# Altium schematic sheet Peripherals.SchDoc
size A4; SheetNumber: 3; SheetTotal: 6
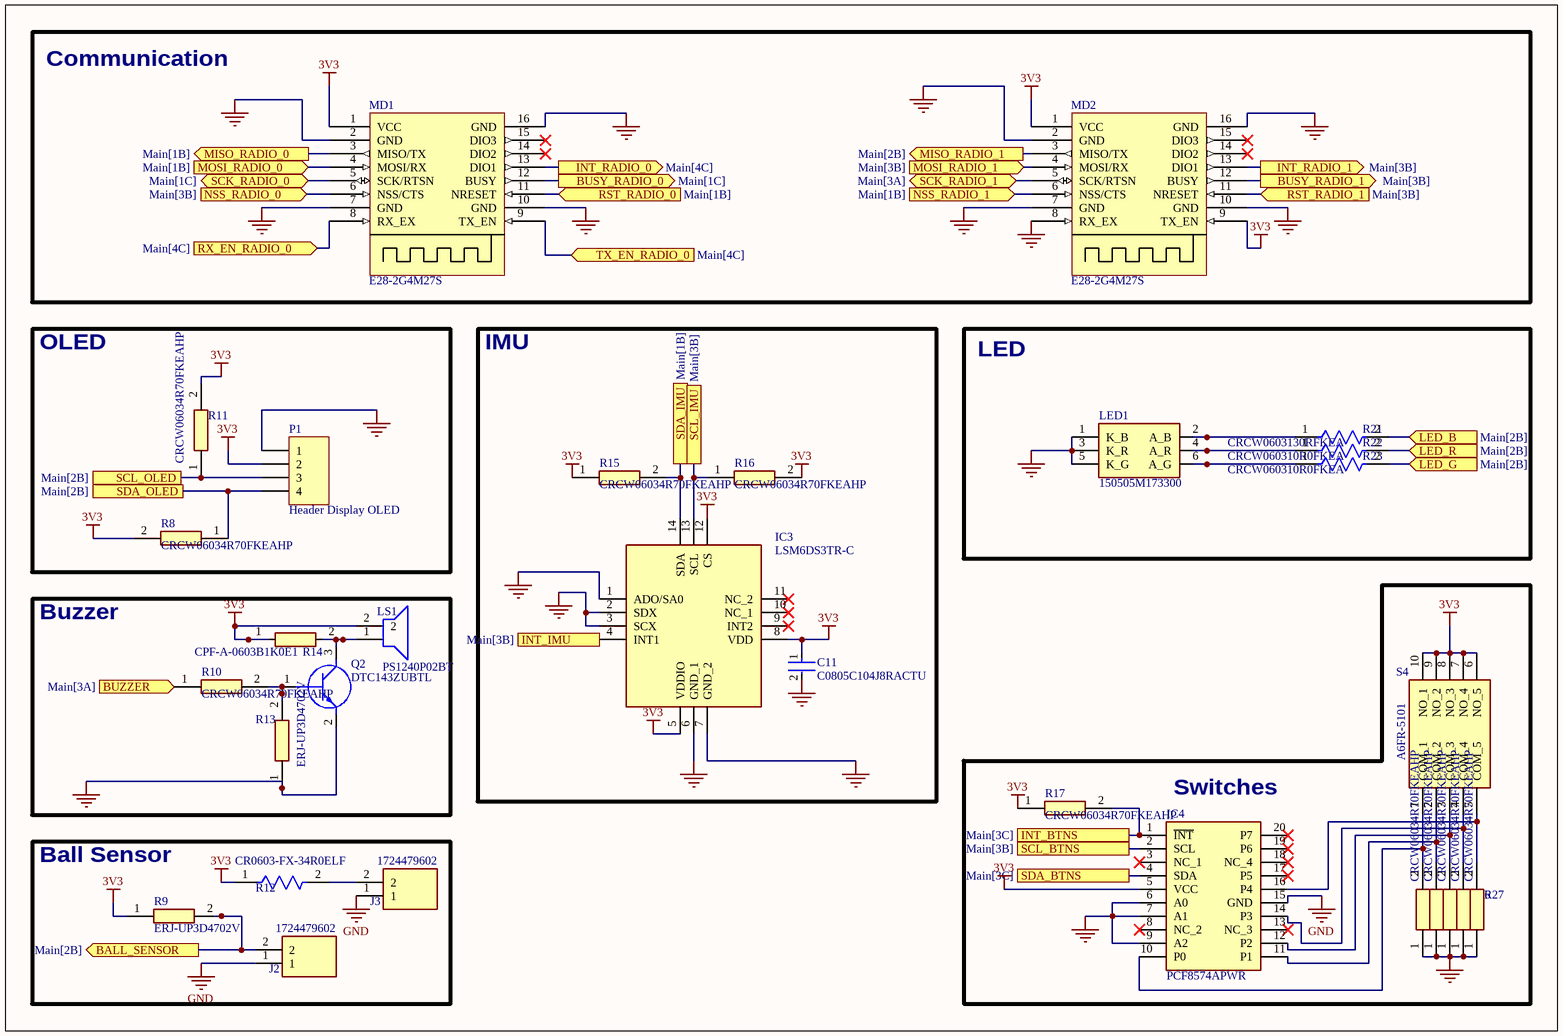
[diagram p0: Peripherals.SchDoc]

## Parts
C11  C0805C104J8RACTU  [FP-C0805C-DN-MFG]
IC3  LSM6DS3TR-C  [LGA-14(2.5X3X0.86)]
IC4  PCF8574APWR  [SOP65P640X120-20N]
J2  1724479602  [172447_94959697_02]
J3  1724479602  [172447_94959697_02]
LED1  150505M173300  [150505M173300]
LS1  PS1240P02BT  [PS1240P02BT]
MD1  E28-2G4M27S  [E28-2G4M27S]
MD2  E28-2G4M27S  [E28-2G4M27S]
P1  Header Display OLED  [OLED]
Q2  DTC143ZUBTL  [SOTFL65P210X105-3N]
R8  CRCW06034R70FKEAHP  [RESC1608X55N]
R9  ERJ-UP3D4702V  [ERJUP3]
R10  CRCW06034R70FKEAHP  [RESC1608X55N]
R11  CRCW06034R70FKEAHP  [RESC1608X55N]
R12  CR0603-FX-34R0ELF  [FP-CR0603-MFG]
R13  ERJ-UP3D4702V  [ERJUP3]
R14  CPF-A-0603B1K0E1  [RESC1608X55N]
R15  CRCW06034R70FKEAHP  [RESC1608X55N]
R16  CRCW06034R70FKEAHP  [RESC1608X55N]
R17  CRCW06034R70FKEAHP  [RESC1608X55N]
R20  CRCW06034R70FKEAHP  [RESC1608X55N]
R21  CRCW0603130RFKEA  [FP-CRCW0603-e3-IPC_A]
R22  CRCW060310R0FKEA  [FP-CRCW0603-e3-IPC_A]
R23  CRCW060310R0FKEA  [FP-CRCW0603-e3-IPC_A]
R24  CRCW06034R70FKEAHP  [RESC1608X55N]
R25  CRCW06034R70FKEAHP  [RESC1608X55N]
R26  CRCW06034R70FKEAHP  [RESC1608X55N]
R27  CRCW06034R70FKEAHP  [RESC1608X55N]
S4  A6FR-5101  [A6FR5101]

## Blocks framed on the sheet
Communication: MD1 MD2
OLED: P1 R8 R11
IMU: C11 IC3 R15 R16
LED: LED1 R21-R23
Buzzer: LS1 Q2 R10 R13 R14
Switches: IC4 R17 R20 R24-R27 S4
Ball Sensor: J2 J3 R9 R12

## Ports
BALL_SENSOR (out, see Main[2B]), BUSY_RADIO_0 (out, see Main[1C]), BUSY_RADIO_1 (out, see Main[3B]), BUZZER (in, see Main[3A]), INT_BTNS (see Main[3C]), INT_IMU (out, see Main[3B]), INT_RADIO_0 (out, see Main[4C]), INT_RADIO_1 (out, see Main[3B]), LED_B (in, see Main[2B]), LED_G (in, see Main[2B]), LED_R (in, see Main[2B]), MISO_RADIO_0 (out, see Main[1B]), MISO_RADIO_1 (out, see Main[2B]), MOSI_RADIO_0 (in, see Main[1B]), MOSI_RADIO_1 (in, see Main[3B]), NSS_RADIO_0 (in, see Main[3B]), NSS_RADIO_1 (in, see Main[1B]), RST_RADIO_0 (in, see Main[1B]), RST_RADIO_1 (in, see Main[3B]), RX_EN_RADIO_0 (in, see Main[4C]), SCK_RADIO_0 (bidir, see Main[1C]), SCK_RADIO_1 (bidir, see Main[3A]), SCL_BTNS (see Main[3B]), SCL_IMU (see Main[3B]), SCL_OLED (see Main[2B]), SDA_BTNS (see Main[3C]), SDA_IMU (see Main[1B]), SDA_OLED (see Main[2B]), TX_EN_RADIO_0 (in, see Main[4C])

## Nets
3V3: C11.1 IC3.5(VDDIO) IC3.8(VDD) IC3.12(CS) IC4.5(VCC) LS1.2 MD1.1(VCC) MD2.1(VCC) MD2.9(TX_EN) P1.2 R8.2 R9.1 R11.2 R12.1 R14.1 R15.1 R16.2 R17.1 S4.6(NO_5) S4.7(NO_4) S4.8(NO_3) S4.9(NO_2) S4.10(NO_1)
GND: C11.2 IC3.1(ADO/SA0) IC3.2(SDX) IC3.3(SCX) IC3.6(GND_1) IC3.7(GND_2) IC4.6(A0) IC4.7(A1) IC4.9(A2) IC4.15(GND) J2.1 J3.1 LED1.1(K_B) LED1.3(K_R) LED1.5(K_G) MD1.2(GND) MD1.7(GND) MD1.10(GND) MD1.16(GND) MD2.2(GND) MD2.7(GND) MD2.8(RX_EX) MD2.10(GND) MD2.16(GND) P1.1 Q2.2(E) R13.1 R20.1 R24.1 R25.1 R26.1 R27.1
BALL_SENSOR: J2.2 R9.2 ; port BALL_SENSOR
BUSY_RADIO_0: MD1.12(BUSY) ; port BUSY_RADIO_0
BUSY_RADIO_1: MD2.12(BUSY) ; port BUSY_RADIO_1
BUZZER: R10.1 ; port BUZZER
INT_BTNS: IC4.1(~{INT}) R17.2 ; port INT_BTNS
INT_IMU: IC3.4(INT1) ; port INT_IMU
INT_RADIO_0: MD1.13(DIO1) ; port INT_RADIO_0
INT_RADIO_1: MD2.13(DIO1) ; port INT_RADIO_1
LED_B: R21.2 ; port LED_B
LED_G: R23.2 ; port LED_G
LED_R: R22.2 ; port LED_R
MISO_RADIO_0: MD1.3(MISO/TX) ; port MISO_RADIO_0
MISO_RADIO_1: MD2.3(MISO/TX) ; port MISO_RADIO_1
MOSI_RADIO_0: MD1.4(MOSI/RX) ; port MOSI_RADIO_0
MOSI_RADIO_1: MD2.4(MOSI/RX) ; port MOSI_RADIO_1
NSS_RADIO_0: MD1.6(NSS/CTS) ; port NSS_RADIO_0
NSS_RADIO_1: MD2.6(NSS/CTS) ; port NSS_RADIO_1
RST_RADIO_0: MD1.11(NRESET) ; port RST_RADIO_0
RST_RADIO_1: MD2.11(NRESET) ; port RST_RADIO_1
RX_EN_RADIO_0: MD1.8(RX_EX) ; port RX_EN_RADIO_0
SCK_RADIO_0: MD1.5(SCK/RTSN) ; port SCK_RADIO_0
SCK_RADIO_1: MD2.5(SCK/RTSN) ; port SCK_RADIO_1
SCL_BTNS: IC4.2(SCL) ; port SCL_BTNS
SCL_IMU: IC3.13(SCL) R16.1 ; port SCL_IMU
SCL_OLED: P1.3 R11.1 ; port SCL_OLED
SDA_BTNS: IC4.4(SDA) ; port SDA_BTNS
SDA_IMU: IC3.14(SDA) R15.2 ; port SDA_IMU
SDA_OLED: P1.4 R8.1 ; port SDA_OLED
TX_EN_RADIO_0: MD1.9(TX_EN) ; port TX_EN_RADIO_0
NetIC4_10: IC4.10(P0) R20.2 S4.1(COM_1)
NetIC4_11: IC4.11(P1) R24.2 S4.2(COM_2)
NetIC4_12: IC4.12(P2) R25.2 S4.3(COM_3)
NetIC4_14: IC4.14(P3) R26.2 S4.4(COM_4)
NetIC4_16: IC4.16(P4) R27.2 S4.5(COM_5)
NetJ3_2: J3.2 R12.2
NetLED1_2: LED1.2(A_B) R21.1
NetLED1_4: LED1.4(A_R) R22.1
NetLED1_6: LED1.6(A_G) R23.1
NetLS1_1: LS1.1 Q2.3(C) R14.2
NetQ2_1: Q2.1(B) R10.2 R13.2

Not connected (* = marked no-connect by the designer): IC3 9(INT2)* 10(NC_1)* 11(NC_2)*; IC4 3(NC_1)* 8(NC_2)* 13(NC_3)* 17(P5)* 18(NC_4)* 19(P6)* 20(P7)*; MD1 14(DIO2)* 15(DIO3)*; MD2 14(DIO2)* 15(DIO3)*

## Library data of the parts
C11 = CMP-03020-032188-1: CAP CER 0.1UF 10V 5% X7R 0805; Manufacturer: KEMET; Material: Ceramic; Tolerance: 0.05; Capacitance: 0.10 μF; Temperature Coefficient: 30ppm/°C; Value: 0.10 μF; Package: C0805C-DN; Device Class L1: Passive Components; Temperature: -55°C to +125°C; Category: Cap; RoHS: TRUE; Mouser Description: Multilayer Ceramic Capacitors MLCC - SMD/SMT 10volts 0.1uF X7R 5%; Lead Free: Yes; Temperature Range Low: -55°C; Temperature Range High: +125°C; Device Class L2: Capacitors; Temperature Characteristic: X7R; Device Class L3: Ceramic Capacitors; ComponentLink2Description: Datasheet; Automotive: No; Ipc Land Pattern Name: CAPC200125X78; Manufacturer Part Number: C0805C104J8RACTU; Voltage Rating: 10 V; Height: 0.88mm; Digikey Description: CAP CER 0.1UF 10V 5% X7R 0805; Octopart: https://octopart.com/c0805c104j8ractu-kemet-11807087; ComponentLink2URL: https://content.kemet.com/datasheets/KEM_C1003_C0G_SMD.pdf
IC3 = LSM6DS3TR-C: Integrated Circuit; Manufacturer_Name: STMicroelectronics; Datasheet Link: http://www.st.com/resource/en/datasheet/lsm6ds3tr-c.pdf; Manufacturer_Part_Number: LSM6DS3TR-C; Mouser Part Number: 511-LSM6DS3TR-C; Mouser Price/Stock: https://www.mouser.co.uk/ProductDetail/STMicroelectronics/LSM6DS3TR-C?qs=u4fy%2FsgLU9NHwPlhP3LTBw%3D%3D; Arrow Part Number: LSM6DS3TR-C; Arrow Price/Stock: https://www.arrow.com/en/products/lsm6ds3tr-c/stmicroelectronics?region=nac
IC4 = PCF8574APWR: Integrated Circuit; Manufacturer_Name: Texas Instruments; Datasheet Link: http://www.ti.com/lit/ds/symlink/pcf8574a.pdf; Height: 1.2mm; Manufacturer_Part_Number: PCF8574APWR; Mouser Part Number: 595-PCF8574APWR; Mouser Price/Stock: https://www.mouser.co.uk/ProductDetail/Texas-Instruments/PCF8574APWR?qs=bkMXpVdiF42gbWVI8U3xeA%3D%3D; Arrow Part Number: PCF8574APWR; Arrow Price/Stock: https://www.arrow.com/en/products/pcf8574apwr/texas-instruments?region=nac
J2 J3 = 1724479602: Connector; Manufacturer_Name: Molex; Datasheet Link: https://www.molex.com/pdm_docs/sd/1724470402_sd.pdf; Height: 12.8mm; Manufacturer_Part_Number: 1724479602
LED1 = 150505M173300: LED; Manufacturer_Name: Wurth Elektronik; Datasheet Link: https://katalog.we-online.de/led/datasheet/150505M173300.pdf; Height: 1.8mm; Manufacturer_Part_Number: 150505M173300; Mouser Part Number: 710-150505M173300; Mouser Price/Stock: https://www.mouser.co.uk/ProductDetail/Wurth-Elektronik/150505M173300?qs=fAHHVMwC%252Bbi%2FURn4Qu0%2FAA%3D%3D
LS1 = PS1240P02BT: Loudspeaker or Buzzer; Manufacturer_Name: TDK; Datasheet Link: https://product.tdk.com/system/files/dam/doc/product/sw_piezo/sw_piezo/piezo-buzzer/catalog/piezoelectronic_buzzer_ps_en.pdf; Manufacturer_Part_Number: PS1240P02BT; Mouser Part Number: 810-PS1240P02BT; Mouser Price/Stock: https://www.mouser.co.uk/ProductDetail/TDK/PS1240P02BT?qs=d7g9p1yFhWaZXSY9MjKMkw%3D%3D; Arrow Part Number: PS1240P02BT; Arrow Price/Stock: https://www.arrow.com/en/products/ps1240p02bt/tdk?region=nac
MD1 MD2 = E28-2G4M27S: E28-2G4M27S Ebyte SX1280 Module
P1 = Header Display OLED: Header, 4-Pin; LatestRevisionDate: 17-Jul-2002; LatestRevisionNote: Re-released for DXP Platform.; Publisher: Altium Limited
Q2 = DTC143ZUBTL: Transistor BJT NPN; Manufacturer_Name: ROHM Semiconductor; Datasheet Link: https://componentsearchengine.com/Datasheets/2/DTC143ZUBTL.pdf; Height: 1.05mm; Manufacturer_Part_Number: DTC143ZUBTL; Mouser Part Number: 755-DTC143ZUBTL; Mouser Price/Stock: https://www.mouser.co.uk/ProductDetail/ROHM-Semiconductor/DTC143ZUBTL?qs=IsRgwgmxh6%2Ffuj9yCN7zBQ%3D%3D
R8 R10 R11 R15-R17 R20 R24-R27 = CRCW06034R70FKEAHP: Resistor; Manufacturer_Name: Vishay; Datasheet Link: http://uk.rs-online.com/web/p/products/8206877; Height: 0.55mm; Manufacturer_Part_Number: CRCW06034R70FKEAHP; Mouser Part Number: 71-CRCW06034R70FKEAH; Mouser Price/Stock: https://www.mouser.co.uk/ProductDetail/Vishay-Dale/CRCW06034R70FKEAHP?qs=zlv9Rr0w%252BHo2DV5S%252Bz7lug%3D%3D; Arrow Part Number: CRCW06034R70FKEAHP; Arrow Price/Stock: https://www.arrow.com/en/products/crcw06034r70fkeahp/vishay?region=nac
R9 R13 = ERJ-UP3D4702V: Resistor; Manufacturer_Name: Panasonic; Datasheet Link: https://industrial.panasonic.com/cdbs/www-data/pdf/RDP0000/AOA0000C337.pdf; Height: 0.55mm; Manufacturer_Part_Number: ERJ-UP3D4702V; Mouser Part Number: 667-ERJ-UP3D4702V; Mouser Price/Stock: https://www.mouser.co.uk/ProductDetail/Panasonic/ERJ-UP3D4702V?qs=GedFDFLaBXG9rkg%252BckNv2g%3D%3D
R12 = CMP-1012-00343-2: Thick Film Chip Resistors 0603 34Ω 0.1W 1% 100ppm/°C; Resistance: 34R; Power Rating: 100mW; Voltage Rating: 50V; Military Standard: Not; Length: 1.6mm; Radiation Hardening: No; Temperature Coefficient: 100ppm/°C; Width: 0.8mm; Depth: 0.8mm; Case Code (Metric): 1608; Max Operating Temperature: 155°C; Tolerance: 1%; Weight: 7.1E-05oz; Contact Plating: Tin; Min Operating Temperature: -55°C; Height: 0.45mm; Mount: Surface Mount; Case Code (Imperial): 0603; Packaging: Tape and Reel; Composition: Thick Film; Termination: SMD/SMT; Case/Package: 0603; Thickness: 457um
R14 = CPF-A-0603B1K0E1: Resistor; Manufacturer_Name: TE Connectivity; Datasheet Link: https://componentsearchengine.com/Datasheets/2/CPF-A-0603B1K0E1.pdf; Height: 0.55mm; Manufacturer_Part_Number: CPF-A-0603B1K0E1; Mouser Part Number: 279-CPF-A-0603B1K0E1; Mouser Price/Stock: https://www.mouser.co.uk/ProductDetail/TE-Connectivity-Holsworthy/CPF-A-0603B1K0E1?qs=Rv6LVDxB0ZpCjx0kmO%252BiwA%3D%3D
R21 = CMP-2000-03889-2: RES Thick Film, 130Ω, 1%, 0.1W, 100ppm/°C, 0603; Working Voltage: 75V; Power Rating: 100mW; Resistance: 130R; Depth: 0.85mm; Max Operating Temperature: 155°C; Width: 0.85mm; Composition: Thick Film; Radiation Hardening: No; Contact Plating: Tin; Tolerance: 1%; Number of Pins: 2; Length: 1.55mm; Case/Package: 0603; Features: Automotive AEC-Q200; Case Code (Metric): 1608; Min Operating Temperature: -55°C; Package Quantity: 10; Temperature Coefficient: 100ppm/°C; Packaging: Tape and Reel; Lead Free: Lead Free; Number of Terminations: 2; Voltage Rating (DC): 75V; Termination: SMD/SMT; Height: 0.45mm; Military Standard: Not; Max Power Dissipation: 100mW; Voltage Rating: 75V; Weight: 7.1E-05oz; Case Code (Imperial): 0603
R22 R23 = CMP-2000-03845-2: RES Thick Film, 10Ω, 1%, 0.1W, 100ppm/°C, 0603; Resistance: 10R; Voltage Rating (DC): 75V; Power Rating: 100mW; Depth: 0.85mm; Height: 0.45mm; Package Quantity: 10; Temperature Coefficient: 100ppm/°C; Weight: 7.1E-05oz; Case Code (Metric): 1608; Number of Terminations: 2; Features: Automotive AEC-Q200; Termination: SMD/SMT; Lead Free: Lead Free; Mount: Surface Mount; Number of Pins: 2; Tolerance: 1%; Max Power Dissipation: 100mW; Width: 0.033inch; Contact Plating: Tin; Case Code (Imperial): 0603; Max Operating Temperature: 155°C; Min Operating Temperature: -55°C; Voltage Rating: 75V; Length: 1.55mm; Case/Package: 0603; Composition: Thick Film; Packaging: Tape and Reel; Military Standard: Not
S4 = A6FR-5101: Switch; Manufacturer_Name: Omron Electronics; Datasheet Link: https://www.mouser.com/datasheet/2/307/omron_03202018_A6FR_datasheet-1314011.pdf; Height: 10.3mm; Manufacturer_Part_Number: A6FR-5101; Mouser Part Number: 653-A6FR-5101; Mouser Price/Stock: https://www.mouser.co.uk/ProductDetail/Omron-Electronics/A6FR-5101?qs=fAHHVMwC%252BbhmGWTU7%252Bb5wg%3D%3D; Arrow Part Number: A6FR-5101; Arrow Price/Stock: https://www.arrow.com/en/products/a6fr5101/omron?region=nac